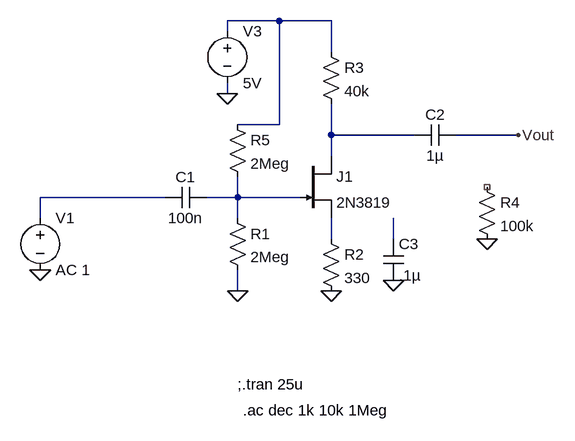
[diagram p0: schematic NType_Discrete_JFET_Amplifier_Design.asc]
NType_Discrete_JFET_Amplifier_Design.asc, the LTspice schematic file:
Version 4
SHEET 1 880 680
WIRE 336 32 256 32
WIRE 416 32 336 32
WIRE 256 48 256 32
WIRE 416 80 416 32
WIRE 256 144 256 128
WIRE 336 192 336 32
WIRE 336 192 272 192
WIRE 416 208 416 160
WIRE 544 208 416 208
WIRE 704 208 608 208
WIRE 416 240 416 208
WIRE 160 304 -32 304
WIRE 272 304 272 272
WIRE 272 304 224 304
WIRE 368 304 272 304
WIRE -32 336 -32 304
WIRE 272 336 272 304
WIRE 416 368 416 336
WIRE 512 368 512 336
WIRE 272 448 272 416
FLAG 272 448 0
FLAG -32 416 0
FLAG 256 144 0
FLAG 656 368 0
FLAG 704 208 Vout
FLAG 416 448 0
FLAG 512 432 0
SYMBOL njf 368 240 R0
SYMATTR InstName J1
SYMATTR Value 2N3819
SYMBOL Res 256 320 R0
SYMATTR InstName R1
SYMATTR Value 2Meg
SYMBOL Cap 224 288 R90
WINDOW 0 0 32 VBottom 2
WINDOW 3 32 32 VTop 2
SYMATTR InstName C1
SYMATTR Value 100n
SYMBOL Voltage -32 320 R0
SYMATTR InstName V1
SYMATTR Value AC 1
SYMBOL Res 400 64 R0
SYMATTR InstName R3
SYMATTR Value 40k
SYMBOL Voltage 256 32 R0
SYMATTR InstName V3
SYMATTR Value 5V
SYMBOL Cap 608 192 R90
WINDOW 0 0 32 VBottom 2
WINDOW 3 32 32 VTop 2
SYMATTR InstName C2
SYMATTR Value 1µ
SYMBOL Res 640 272 R0
SYMATTR InstName R4
SYMATTR Value 100k
SYMBOL Res 400 352 R0
SYMATTR InstName R2
SYMATTR Value 330
SYMBOL Cap 496 368 R0
SYMATTR InstName C3
SYMATTR Value .1µ
SYMBOL Res 256 176 R0
SYMATTR InstName R5
SYMATTR Value 2Meg
TEXT 272 592 Left 2 !;.tran 25u
TEXT 280 632 Left 2 !.ac dec 1k 10k 1Meg

The netlist it stands for:
* NType_Discrete_JFET_Amplifier_Design.asc
J1 N002 N004 N005 2N3819
R1 N004 0 2Meg
C1 N004 N003 100n
V1 N003 0 AC 1
R3 N001 N002 40k
V3 N001 0 5V
C2 Vout N002 1µ
R4 NC_01 0 100k
R2 N005 0 330
C3 N006 0 .1µ
R5 N001 N004 2Meg
.model NJF NJF
.model PJF PJF
.lib standard.jft
;.tran 25u
.ac dec 1k 10k 1Meg
.backanno
.end